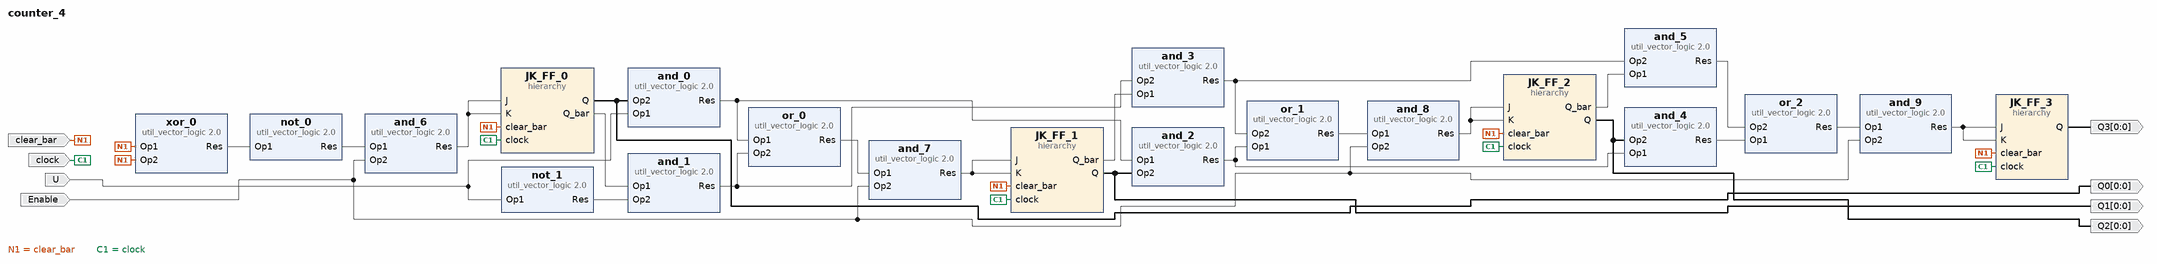
[diagram p0: block diagram of the top level]
# Vivado block design counter_4, xc7a35tcpg236-1, Vivado 2019.1
create_bd_design counter_4

create_bd_port -dir I clear_bar
create_bd_port -dir I clock
create_bd_port -dir I U
create_bd_port -dir O -from 0 -to 0 Q0
create_bd_port -dir O -from 0 -to 0 Q1
create_bd_port -dir O -from 0 -to 0 Q2
create_bd_port -dir O -from 0 -to 0 Q3
create_bd_port -dir I Enable

create_bd_cell -type hier JK_FF_0
create_bd_cell -type hier JK_FF_1
create_bd_cell -type hier JK_FF_2
create_bd_cell -type hier JK_FF_3
create_bd_cell -type ip -vlnv xilinx.com:ip:util_vector_logic:2.0 xor_0
set_property -dict {CONFIG.C_OPERATION xor CONFIG.C_SIZE 1} [get_bd_cells xor_0]
create_bd_cell -type ip -vlnv xilinx.com:ip:util_vector_logic:2.0 not_0
set_property -dict {CONFIG.C_OPERATION not CONFIG.C_SIZE 1} [get_bd_cells not_0]
create_bd_cell -type ip -vlnv xilinx.com:ip:util_vector_logic:2.0 and_0
set_property -dict {CONFIG.C_SIZE 1} [get_bd_cells and_0]
create_bd_cell -type ip -vlnv xilinx.com:ip:util_vector_logic:2.0 and_1
set_property -dict {CONFIG.C_SIZE 1} [get_bd_cells and_1]
create_bd_cell -type ip -vlnv xilinx.com:ip:util_vector_logic:2.0 not_1
set_property -dict {CONFIG.C_OPERATION not CONFIG.C_SIZE 1} [get_bd_cells not_1]
create_bd_cell -type ip -vlnv xilinx.com:ip:util_vector_logic:2.0 or_0
set_property -dict {CONFIG.C_OPERATION or CONFIG.C_SIZE 1} [get_bd_cells or_0]
create_bd_cell -type ip -vlnv xilinx.com:ip:util_vector_logic:2.0 and_2
set_property -dict {CONFIG.C_SIZE 1} [get_bd_cells and_2]
create_bd_cell -type ip -vlnv xilinx.com:ip:util_vector_logic:2.0 and_3
set_property -dict {CONFIG.C_SIZE 1} [get_bd_cells and_3]
create_bd_cell -type ip -vlnv xilinx.com:ip:util_vector_logic:2.0 or_1
set_property -dict {CONFIG.C_OPERATION or CONFIG.C_SIZE 1} [get_bd_cells or_1]
create_bd_cell -type ip -vlnv xilinx.com:ip:util_vector_logic:2.0 and_4
set_property -dict {CONFIG.C_SIZE 1} [get_bd_cells and_4]
create_bd_cell -type ip -vlnv xilinx.com:ip:util_vector_logic:2.0 and_5
set_property -dict {CONFIG.C_SIZE 1} [get_bd_cells and_5]
create_bd_cell -type ip -vlnv xilinx.com:ip:util_vector_logic:2.0 or_2
set_property -dict {CONFIG.C_OPERATION or CONFIG.C_SIZE 1} [get_bd_cells or_2]
create_bd_cell -type ip -vlnv xilinx.com:ip:util_vector_logic:2.0 and_6
set_property -dict {CONFIG.C_SIZE 1} [get_bd_cells and_6]
create_bd_cell -type ip -vlnv xilinx.com:ip:util_vector_logic:2.0 and_7
set_property -dict {CONFIG.C_SIZE 1} [get_bd_cells and_7]
create_bd_cell -type ip -vlnv xilinx.com:ip:util_vector_logic:2.0 and_8
set_property -dict {CONFIG.C_SIZE 1} [get_bd_cells and_8]
create_bd_cell -type ip -vlnv xilinx.com:ip:util_vector_logic:2.0 and_9
set_property -dict {CONFIG.C_SIZE 1} [get_bd_cells and_9]

# ---- hierarchy /JK_FF_0 ----
current_bd_instance /JK_FF_0
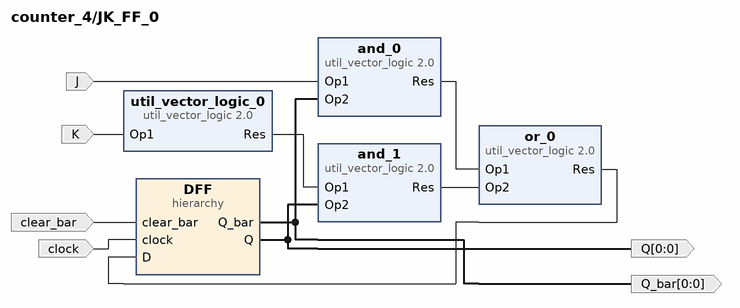
[diagram p1: block diagram inside /JK_FF_0]
create_bd_pin -dir I J
create_bd_pin -dir I K
create_bd_pin -dir I clock
create_bd_pin -dir I clear_bar
create_bd_pin -dir O -from 0 -to 0 Q
create_bd_pin -dir O -from 0 -to 0 Q_bar

create_bd_cell -type hier DFF
create_bd_cell -type ip -vlnv xilinx.com:ip:util_vector_logic:2.0 and_0
set_property -dict {CONFIG.C_SIZE 1} [get_bd_cells and_0]
create_bd_cell -type ip -vlnv xilinx.com:ip:util_vector_logic:2.0 or_0
set_property -dict {CONFIG.C_OPERATION or CONFIG.C_SIZE 1} [get_bd_cells or_0]
create_bd_cell -type ip -vlnv xilinx.com:ip:util_vector_logic:2.0 util_vector_logic_0
set_property -dict {CONFIG.C_OPERATION not CONFIG.C_SIZE 1} [get_bd_cells util_vector_logic_0]
create_bd_cell -type ip -vlnv xilinx.com:ip:util_vector_logic:2.0 and_1
set_property -dict {CONFIG.C_SIZE 1} [get_bd_cells and_1]

# ---- hierarchy /JK_FF_0/DFF ----
current_bd_instance /JK_FF_0/DFF
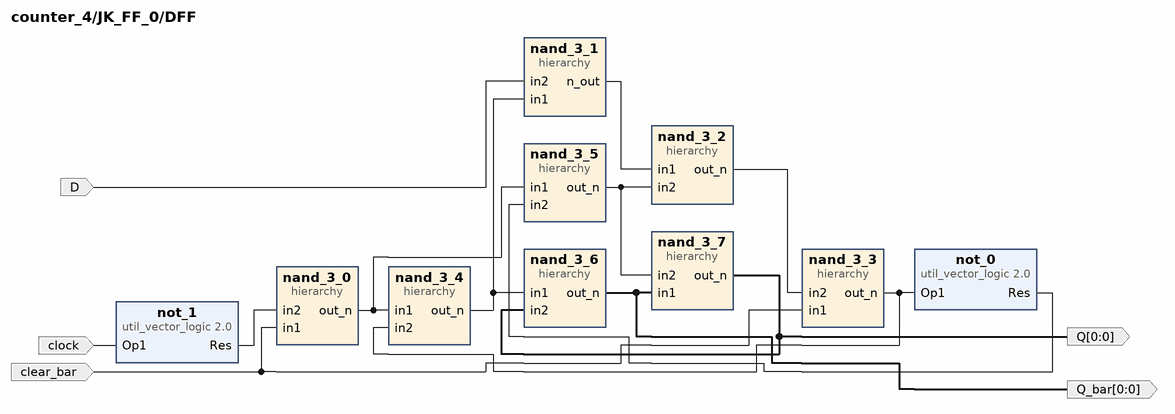
[diagram p2: block diagram inside /JK_FF_0/DFF]
create_bd_pin -dir I clear_bar
create_bd_pin -dir I clock
create_bd_pin -dir I D
create_bd_pin -dir O -from 0 -to 0 Q_bar
create_bd_pin -dir O -from 0 -to 0 Q

create_bd_cell -type hier nand_3_0
create_bd_cell -type hier nand_3_1
create_bd_cell -type ip -vlnv xilinx.com:ip:util_vector_logic:2.0 not_0
set_property -dict {CONFIG.C_OPERATION not CONFIG.C_SIZE 1} [get_bd_cells not_0]
create_bd_cell -type hier nand_3_2
create_bd_cell -type hier nand_3_3
create_bd_cell -type hier nand_3_4
create_bd_cell -type hier nand_3_5
create_bd_cell -type hier nand_3_6
create_bd_cell -type hier nand_3_7
create_bd_cell -type ip -vlnv xilinx.com:ip:util_vector_logic:2.0 not_1
set_property -dict {CONFIG.C_OPERATION not CONFIG.C_SIZE 1} [get_bd_cells not_1]

# ---- hierarchy /JK_FF_0/DFF/nand_3_0 ----
current_bd_instance /JK_FF_0/DFF/nand_3_0
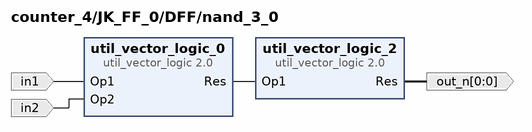
[diagram p3: block diagram inside /JK_FF_0/DFF/nand_3_0]
create_bd_pin -dir I in1
create_bd_pin -dir I in2
create_bd_pin -dir O -from 0 -to 0 out_n

create_bd_cell -type ip -vlnv xilinx.com:ip:util_vector_logic:2.0 util_vector_logic_0
set_property -dict {CONFIG.C_OPERATION and CONFIG.C_SIZE 1} [get_bd_cells util_vector_logic_0]
create_bd_cell -type ip -vlnv xilinx.com:ip:util_vector_logic:2.0 util_vector_logic_2
set_property -dict {CONFIG.C_OPERATION not CONFIG.C_SIZE 1} [get_bd_cells util_vector_logic_2]

# ---- hierarchy /JK_FF_0/DFF/nand_3_1 ----
current_bd_instance /JK_FF_0/DFF/nand_3_1
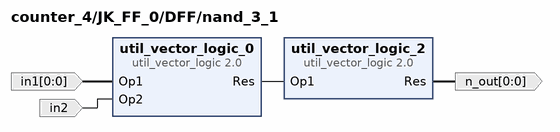
[diagram p4: block diagram inside /JK_FF_0/DFF/nand_3_1]
create_bd_pin -dir I -from 0 -to 0 in1
create_bd_pin -dir I in2
create_bd_pin -dir O -from 0 -to 0 n_out

create_bd_cell -type ip -vlnv xilinx.com:ip:util_vector_logic:2.0 util_vector_logic_0
set_property -dict {CONFIG.C_OPERATION and CONFIG.C_SIZE 1} [get_bd_cells util_vector_logic_0]
create_bd_cell -type ip -vlnv xilinx.com:ip:util_vector_logic:2.0 util_vector_logic_2
set_property -dict {CONFIG.C_OPERATION not CONFIG.C_SIZE 1} [get_bd_cells util_vector_logic_2]

# ---- hierarchy /JK_FF_0/DFF/nand_3_2 ----
current_bd_instance /JK_FF_0/DFF/nand_3_2
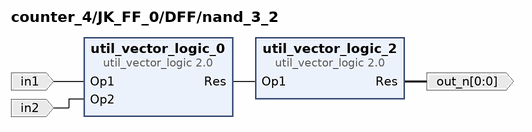
[diagram p5: block diagram inside /JK_FF_0/DFF/nand_3_2]
create_bd_pin -dir I in1
create_bd_pin -dir I in2
create_bd_pin -dir O -from 0 -to 0 out_n

create_bd_cell -type ip -vlnv xilinx.com:ip:util_vector_logic:2.0 util_vector_logic_0
set_property -dict {CONFIG.C_OPERATION and CONFIG.C_SIZE 1} [get_bd_cells util_vector_logic_0]
create_bd_cell -type ip -vlnv xilinx.com:ip:util_vector_logic:2.0 util_vector_logic_2
set_property -dict {CONFIG.C_OPERATION not CONFIG.C_SIZE 1} [get_bd_cells util_vector_logic_2]

# ---- hierarchy /JK_FF_0/DFF/nand_3_3 ----
current_bd_instance /JK_FF_0/DFF/nand_3_3
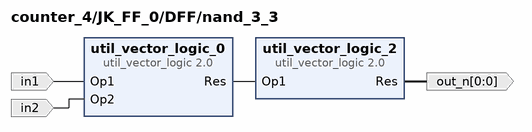
[diagram p6: block diagram inside /JK_FF_0/DFF/nand_3_3]
create_bd_pin -dir I in1
create_bd_pin -dir I in2
create_bd_pin -dir O -from 0 -to 0 out_n

create_bd_cell -type ip -vlnv xilinx.com:ip:util_vector_logic:2.0 util_vector_logic_0
set_property -dict {CONFIG.C_OPERATION and CONFIG.C_SIZE 1} [get_bd_cells util_vector_logic_0]
create_bd_cell -type ip -vlnv xilinx.com:ip:util_vector_logic:2.0 util_vector_logic_2
set_property -dict {CONFIG.C_OPERATION not CONFIG.C_SIZE 1} [get_bd_cells util_vector_logic_2]

# ---- hierarchy /JK_FF_0/DFF/nand_3_4 ----
current_bd_instance /JK_FF_0/DFF/nand_3_4
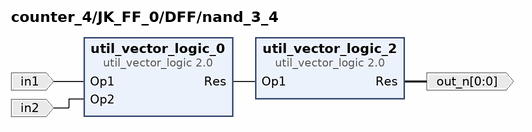
[diagram p7: block diagram inside /JK_FF_0/DFF/nand_3_4]
create_bd_pin -dir I in1
create_bd_pin -dir I in2
create_bd_pin -dir O -from 0 -to 0 out_n

create_bd_cell -type ip -vlnv xilinx.com:ip:util_vector_logic:2.0 util_vector_logic_0
set_property -dict {CONFIG.C_OPERATION and CONFIG.C_SIZE 1} [get_bd_cells util_vector_logic_0]
create_bd_cell -type ip -vlnv xilinx.com:ip:util_vector_logic:2.0 util_vector_logic_2
set_property -dict {CONFIG.C_OPERATION not CONFIG.C_SIZE 1} [get_bd_cells util_vector_logic_2]

# ---- hierarchy /JK_FF_0/DFF/nand_3_5 ----
current_bd_instance /JK_FF_0/DFF/nand_3_5
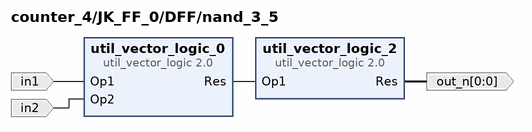
[diagram p8: block diagram inside /JK_FF_0/DFF/nand_3_5]
create_bd_pin -dir I in1
create_bd_pin -dir I in2
create_bd_pin -dir O -from 0 -to 0 out_n

create_bd_cell -type ip -vlnv xilinx.com:ip:util_vector_logic:2.0 util_vector_logic_0
set_property -dict {CONFIG.C_OPERATION and CONFIG.C_SIZE 1} [get_bd_cells util_vector_logic_0]
create_bd_cell -type ip -vlnv xilinx.com:ip:util_vector_logic:2.0 util_vector_logic_2
set_property -dict {CONFIG.C_OPERATION not CONFIG.C_SIZE 1} [get_bd_cells util_vector_logic_2]

# ---- hierarchy /JK_FF_0/DFF/nand_3_6 ----
current_bd_instance /JK_FF_0/DFF/nand_3_6
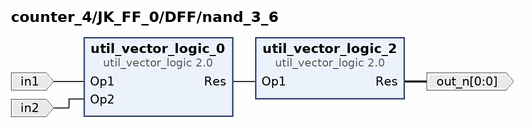
[diagram p9: block diagram inside /JK_FF_0/DFF/nand_3_6]
create_bd_pin -dir I in1
create_bd_pin -dir I in2
create_bd_pin -dir O -from 0 -to 0 out_n

create_bd_cell -type ip -vlnv xilinx.com:ip:util_vector_logic:2.0 util_vector_logic_0
set_property -dict {CONFIG.C_OPERATION and CONFIG.C_SIZE 1} [get_bd_cells util_vector_logic_0]
create_bd_cell -type ip -vlnv xilinx.com:ip:util_vector_logic:2.0 util_vector_logic_2
set_property -dict {CONFIG.C_OPERATION not CONFIG.C_SIZE 1} [get_bd_cells util_vector_logic_2]

# ---- hierarchy /JK_FF_0/DFF/nand_3_7 ----
current_bd_instance /JK_FF_0/DFF/nand_3_7
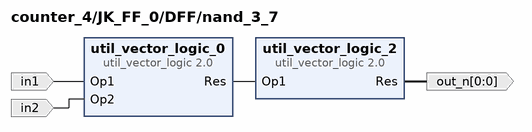
[diagram p10: block diagram inside /JK_FF_0/DFF/nand_3_7]
create_bd_pin -dir I in1
create_bd_pin -dir I in2
create_bd_pin -dir O -from 0 -to 0 out_n

create_bd_cell -type ip -vlnv xilinx.com:ip:util_vector_logic:2.0 util_vector_logic_0
set_property -dict {CONFIG.C_OPERATION and CONFIG.C_SIZE 1} [get_bd_cells util_vector_logic_0]
create_bd_cell -type ip -vlnv xilinx.com:ip:util_vector_logic:2.0 util_vector_logic_2
set_property -dict {CONFIG.C_OPERATION not CONFIG.C_SIZE 1} [get_bd_cells util_vector_logic_2]

# ---- hierarchy /JK_FF_1 ----
current_bd_instance /JK_FF_1
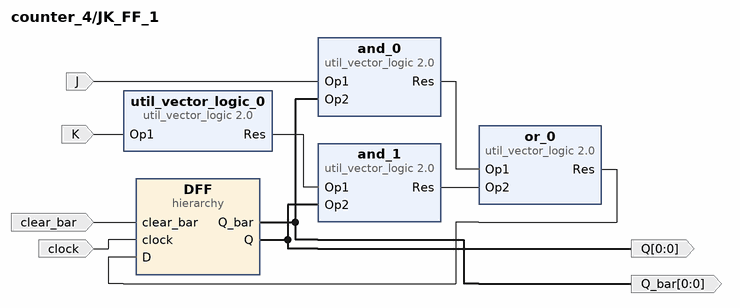
[diagram p11: block diagram inside /JK_FF_1]
create_bd_pin -dir I J
create_bd_pin -dir I K
create_bd_pin -dir I clock
create_bd_pin -dir I clear_bar
create_bd_pin -dir O -from 0 -to 0 Q
create_bd_pin -dir O -from 0 -to 0 Q_bar

create_bd_cell -type hier DFF
create_bd_cell -type ip -vlnv xilinx.com:ip:util_vector_logic:2.0 and_0
set_property -dict {CONFIG.C_SIZE 1} [get_bd_cells and_0]
create_bd_cell -type ip -vlnv xilinx.com:ip:util_vector_logic:2.0 or_0
set_property -dict {CONFIG.C_OPERATION or CONFIG.C_SIZE 1} [get_bd_cells or_0]
create_bd_cell -type ip -vlnv xilinx.com:ip:util_vector_logic:2.0 util_vector_logic_0
set_property -dict {CONFIG.C_OPERATION not CONFIG.C_SIZE 1} [get_bd_cells util_vector_logic_0]
create_bd_cell -type ip -vlnv xilinx.com:ip:util_vector_logic:2.0 and_1
set_property -dict {CONFIG.C_SIZE 1} [get_bd_cells and_1]

# ---- hierarchy /JK_FF_1/DFF ----
current_bd_instance /JK_FF_1/DFF
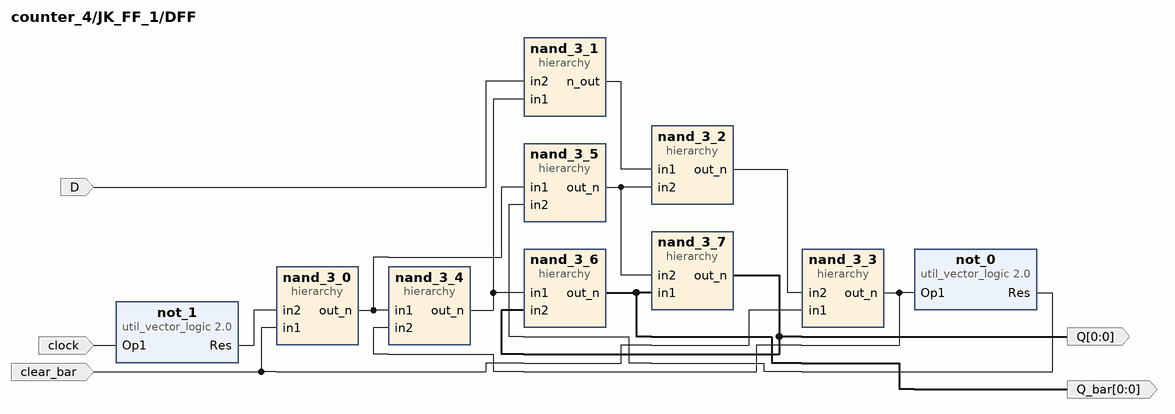
[diagram p12: block diagram inside /JK_FF_1/DFF]
create_bd_pin -dir I clear_bar
create_bd_pin -dir I clock
create_bd_pin -dir I D
create_bd_pin -dir O -from 0 -to 0 Q_bar
create_bd_pin -dir O -from 0 -to 0 Q

create_bd_cell -type hier nand_3_0
create_bd_cell -type hier nand_3_1
create_bd_cell -type ip -vlnv xilinx.com:ip:util_vector_logic:2.0 not_0
set_property -dict {CONFIG.C_OPERATION not CONFIG.C_SIZE 1} [get_bd_cells not_0]
create_bd_cell -type hier nand_3_2
create_bd_cell -type hier nand_3_3
create_bd_cell -type hier nand_3_4
create_bd_cell -type hier nand_3_5
create_bd_cell -type hier nand_3_6
create_bd_cell -type hier nand_3_7
create_bd_cell -type ip -vlnv xilinx.com:ip:util_vector_logic:2.0 not_1
set_property -dict {CONFIG.C_OPERATION not CONFIG.C_SIZE 1} [get_bd_cells not_1]

# ---- hierarchy /JK_FF_1/DFF/nand_3_0 ----
current_bd_instance /JK_FF_1/DFF/nand_3_0
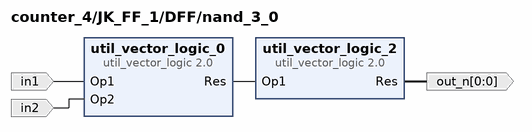
[diagram p13: block diagram inside /JK_FF_1/DFF/nand_3_0]
create_bd_pin -dir I in1
create_bd_pin -dir I in2
create_bd_pin -dir O -from 0 -to 0 out_n

create_bd_cell -type ip -vlnv xilinx.com:ip:util_vector_logic:2.0 util_vector_logic_0
set_property -dict {CONFIG.C_OPERATION and CONFIG.C_SIZE 1} [get_bd_cells util_vector_logic_0]
create_bd_cell -type ip -vlnv xilinx.com:ip:util_vector_logic:2.0 util_vector_logic_2
set_property -dict {CONFIG.C_OPERATION not CONFIG.C_SIZE 1} [get_bd_cells util_vector_logic_2]

# ---- hierarchy /JK_FF_1/DFF/nand_3_1 ----
current_bd_instance /JK_FF_1/DFF/nand_3_1
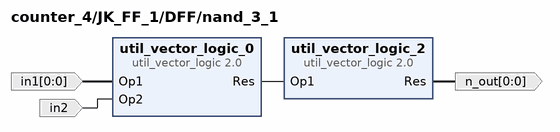
[diagram p14: block diagram inside /JK_FF_1/DFF/nand_3_1]
create_bd_pin -dir I -from 0 -to 0 in1
create_bd_pin -dir I in2
create_bd_pin -dir O -from 0 -to 0 n_out

create_bd_cell -type ip -vlnv xilinx.com:ip:util_vector_logic:2.0 util_vector_logic_0
set_property -dict {CONFIG.C_OPERATION and CONFIG.C_SIZE 1} [get_bd_cells util_vector_logic_0]
create_bd_cell -type ip -vlnv xilinx.com:ip:util_vector_logic:2.0 util_vector_logic_2
set_property -dict {CONFIG.C_OPERATION not CONFIG.C_SIZE 1} [get_bd_cells util_vector_logic_2]

# ---- hierarchy /JK_FF_1/DFF/nand_3_2 ----
current_bd_instance /JK_FF_1/DFF/nand_3_2
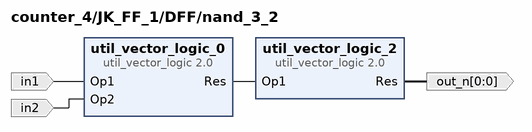
[diagram p15: block diagram inside /JK_FF_1/DFF/nand_3_2]
create_bd_pin -dir I in1
create_bd_pin -dir I in2
create_bd_pin -dir O -from 0 -to 0 out_n

create_bd_cell -type ip -vlnv xilinx.com:ip:util_vector_logic:2.0 util_vector_logic_0
set_property -dict {CONFIG.C_OPERATION and CONFIG.C_SIZE 1} [get_bd_cells util_vector_logic_0]
create_bd_cell -type ip -vlnv xilinx.com:ip:util_vector_logic:2.0 util_vector_logic_2
set_property -dict {CONFIG.C_OPERATION not CONFIG.C_SIZE 1} [get_bd_cells util_vector_logic_2]

# ---- hierarchy /JK_FF_1/DFF/nand_3_3 ----
current_bd_instance /JK_FF_1/DFF/nand_3_3
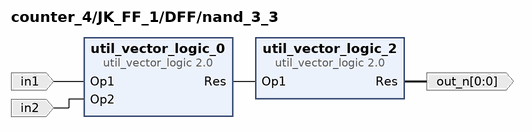
[diagram p16: block diagram inside /JK_FF_1/DFF/nand_3_3]
create_bd_pin -dir I in1
create_bd_pin -dir I in2
create_bd_pin -dir O -from 0 -to 0 out_n

create_bd_cell -type ip -vlnv xilinx.com:ip:util_vector_logic:2.0 util_vector_logic_0
set_property -dict {CONFIG.C_OPERATION and CONFIG.C_SIZE 1} [get_bd_cells util_vector_logic_0]
create_bd_cell -type ip -vlnv xilinx.com:ip:util_vector_logic:2.0 util_vector_logic_2
set_property -dict {CONFIG.C_OPERATION not CONFIG.C_SIZE 1} [get_bd_cells util_vector_logic_2]

# ---- hierarchy /JK_FF_1/DFF/nand_3_4 ----
current_bd_instance /JK_FF_1/DFF/nand_3_4
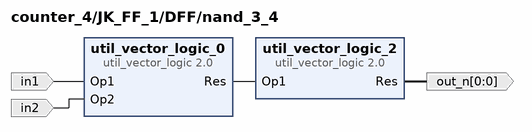
[diagram p17: block diagram inside /JK_FF_1/DFF/nand_3_4]
create_bd_pin -dir I in1
create_bd_pin -dir I in2
create_bd_pin -dir O -from 0 -to 0 out_n

create_bd_cell -type ip -vlnv xilinx.com:ip:util_vector_logic:2.0 util_vector_logic_0
set_property -dict {CONFIG.C_OPERATION and CONFIG.C_SIZE 1} [get_bd_cells util_vector_logic_0]
create_bd_cell -type ip -vlnv xilinx.com:ip:util_vector_logic:2.0 util_vector_logic_2
set_property -dict {CONFIG.C_OPERATION not CONFIG.C_SIZE 1} [get_bd_cells util_vector_logic_2]

# ---- hierarchy /JK_FF_1/DFF/nand_3_5 ----
current_bd_instance /JK_FF_1/DFF/nand_3_5
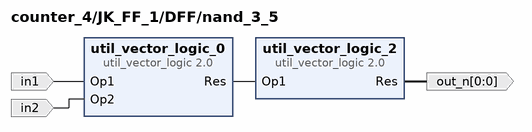
[diagram p18: block diagram inside /JK_FF_1/DFF/nand_3_5]
create_bd_pin -dir I in1
create_bd_pin -dir I in2
create_bd_pin -dir O -from 0 -to 0 out_n

create_bd_cell -type ip -vlnv xilinx.com:ip:util_vector_logic:2.0 util_vector_logic_0
set_property -dict {CONFIG.C_OPERATION and CONFIG.C_SIZE 1} [get_bd_cells util_vector_logic_0]
create_bd_cell -type ip -vlnv xilinx.com:ip:util_vector_logic:2.0 util_vector_logic_2
set_property -dict {CONFIG.C_OPERATION not CONFIG.C_SIZE 1} [get_bd_cells util_vector_logic_2]

# ---- hierarchy /JK_FF_1/DFF/nand_3_6 ----
current_bd_instance /JK_FF_1/DFF/nand_3_6
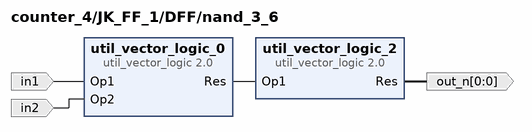
[diagram p19: block diagram inside /JK_FF_1/DFF/nand_3_6]
create_bd_pin -dir I in1
create_bd_pin -dir I in2
create_bd_pin -dir O -from 0 -to 0 out_n

create_bd_cell -type ip -vlnv xilinx.com:ip:util_vector_logic:2.0 util_vector_logic_0
set_property -dict {CONFIG.C_OPERATION and CONFIG.C_SIZE 1} [get_bd_cells util_vector_logic_0]
create_bd_cell -type ip -vlnv xilinx.com:ip:util_vector_logic:2.0 util_vector_logic_2
set_property -dict {CONFIG.C_OPERATION not CONFIG.C_SIZE 1} [get_bd_cells util_vector_logic_2]

# ---- hierarchy /JK_FF_1/DFF/nand_3_7 ----
current_bd_instance /JK_FF_1/DFF/nand_3_7
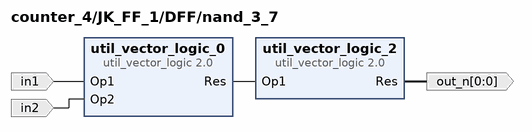
[diagram p20: block diagram inside /JK_FF_1/DFF/nand_3_7]
create_bd_pin -dir I in1
create_bd_pin -dir I in2
create_bd_pin -dir O -from 0 -to 0 out_n

create_bd_cell -type ip -vlnv xilinx.com:ip:util_vector_logic:2.0 util_vector_logic_0
set_property -dict {CONFIG.C_OPERATION and CONFIG.C_SIZE 1} [get_bd_cells util_vector_logic_0]
create_bd_cell -type ip -vlnv xilinx.com:ip:util_vector_logic:2.0 util_vector_logic_2
set_property -dict {CONFIG.C_OPERATION not CONFIG.C_SIZE 1} [get_bd_cells util_vector_logic_2]

# ---- hierarchy /JK_FF_2 ----
current_bd_instance /JK_FF_2
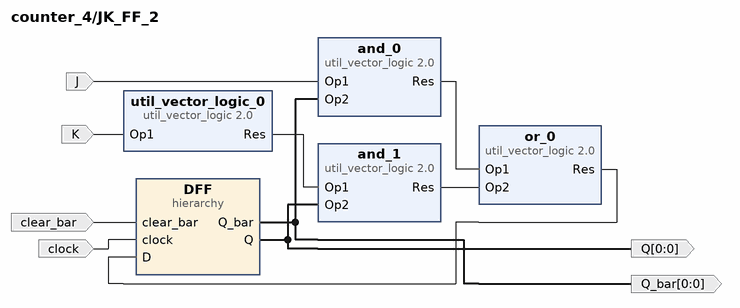
[diagram p21: block diagram inside /JK_FF_2]
create_bd_pin -dir I J
create_bd_pin -dir I K
create_bd_pin -dir I clock
create_bd_pin -dir I clear_bar
create_bd_pin -dir O -from 0 -to 0 Q
create_bd_pin -dir O -from 0 -to 0 Q_bar

create_bd_cell -type hier DFF
create_bd_cell -type ip -vlnv xilinx.com:ip:util_vector_logic:2.0 and_0
set_property -dict {CONFIG.C_SIZE 1} [get_bd_cells and_0]
create_bd_cell -type ip -vlnv xilinx.com:ip:util_vector_logic:2.0 or_0
set_property -dict {CONFIG.C_OPERATION or CONFIG.C_SIZE 1} [get_bd_cells or_0]
create_bd_cell -type ip -vlnv xilinx.com:ip:util_vector_logic:2.0 util_vector_logic_0
set_property -dict {CONFIG.C_OPERATION not CONFIG.C_SIZE 1} [get_bd_cells util_vector_logic_0]
create_bd_cell -type ip -vlnv xilinx.com:ip:util_vector_logic:2.0 and_1
set_property -dict {CONFIG.C_SIZE 1} [get_bd_cells and_1]

# ---- hierarchy /JK_FF_2/DFF ----
current_bd_instance /JK_FF_2/DFF
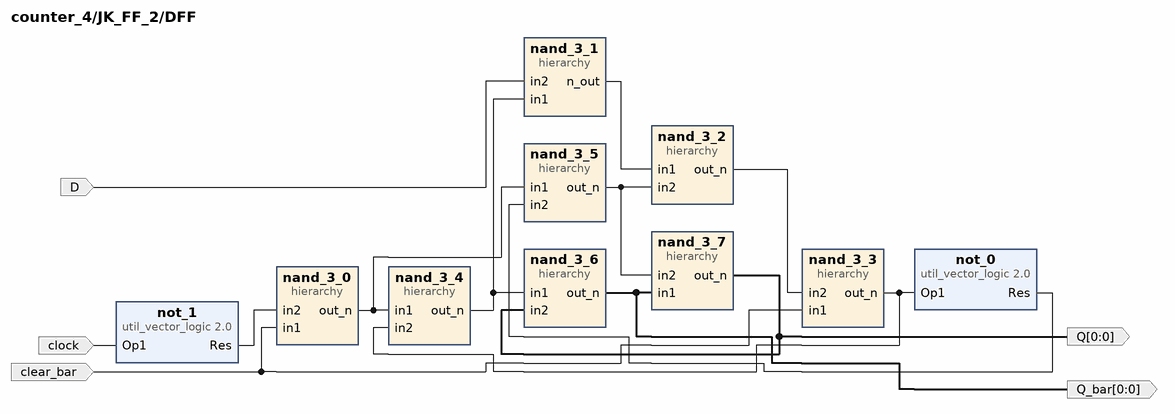
[diagram p22: block diagram inside /JK_FF_2/DFF]
create_bd_pin -dir I clear_bar
create_bd_pin -dir I clock
create_bd_pin -dir I D
create_bd_pin -dir O -from 0 -to 0 Q_bar
create_bd_pin -dir O -from 0 -to 0 Q

create_bd_cell -type hier nand_3_0
create_bd_cell -type hier nand_3_1
create_bd_cell -type ip -vlnv xilinx.com:ip:util_vector_logic:2.0 not_0
set_property -dict {CONFIG.C_OPERATION not CONFIG.C_SIZE 1} [get_bd_cells not_0]
create_bd_cell -type hier nand_3_2
create_bd_cell -type hier nand_3_3
create_bd_cell -type hier nand_3_4
create_bd_cell -type hier nand_3_5
create_bd_cell -type hier nand_3_6
create_bd_cell -type hier nand_3_7
create_bd_cell -type ip -vlnv xilinx.com:ip:util_vector_logic:2.0 not_1
set_property -dict {CONFIG.C_OPERATION not CONFIG.C_SIZE 1} [get_bd_cells not_1]

# ---- hierarchy /JK_FF_2/DFF/nand_3_0 ----
current_bd_instance /JK_FF_2/DFF/nand_3_0
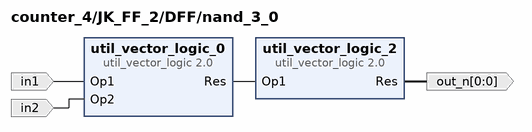
[diagram p23: block diagram inside /JK_FF_2/DFF/nand_3_0]
create_bd_pin -dir I in1
create_bd_pin -dir I in2
create_bd_pin -dir O -from 0 -to 0 out_n

create_bd_cell -type ip -vlnv xilinx.com:ip:util_vector_logic:2.0 util_vector_logic_0
set_property -dict {CONFIG.C_OPERATION and CONFIG.C_SIZE 1} [get_bd_cells util_vector_logic_0]
create_bd_cell -type ip -vlnv xilinx.com:ip:util_vector_logic:2.0 util_vector_logic_2
set_property -dict {CONFIG.C_OPERATION not CONFIG.C_SIZE 1} [get_bd_cells util_vector_logic_2]

# ---- hierarchy /JK_FF_2/DFF/nand_3_1 ----
current_bd_instance /JK_FF_2/DFF/nand_3_1
